# Altium schematic sheet MiniAB-Board.schdoc
size A4
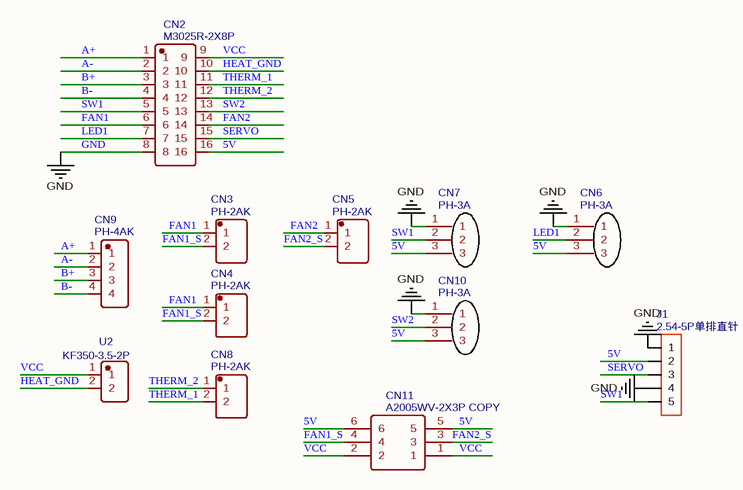
[diagram p0: MiniAB-Board.schdoc]

## Parts
CN2  M3025R-2X8P  [CONN-TH_M3025R-2X8P]
CN3  PH-2AK  [CONN-TH_PH-2A]
CN4  PH-2AK  [CONN-TH_PH-2A]
CN5  PH-2AK  [CONN-TH_PH-2A]
CN6  PH-3A  [CONN-TH_3P-P2.00_PH-3AK]
CN7  PH-3A  [CONN-TH_3P-P2.00_PH-3AK]
CN8  PH-2AK  [CONN-TH_PH-2A]
CN9  PH-4AK  [CONN-TH_PH-4AK]
CN10  PH-3A  [CONN-TH_3P-P2.00_PH-3AK]
CN11  A2005WV-2X3P COPY  [HDR-TH_6P-P2.00-V-M-R2-C3-S2.00]
J1  2.54-5P单排直针  [2.54-5P直针]
U2  KF350-3.5-2P  [CONN-TH_P3.50_KF350-3.5-2P]

## Nets
GND: CN2.8 CN6.1 CN7.1 CN10.1 J1.1 J1.4
5V: CN2.16 CN6.3 CN7.3 CN10.3 CN11.5 CN11.6 J1.2
A+: CN2.1 CN9.1
A-: CN2.2 CN9.2
B+: CN2.3 CN9.3
B-: CN2.4 CN9.4
FAN1: CN2.6 CN3.1 CN4.1
FAN1_S: CN3.2 CN4.2 CN11.4
FAN2: CN2.14 CN5.1
FAN2_S: CN5.2 CN11.3
HEAT_GND: CN2.10 U2.2
LED1: CN2.7 CN6.2
SERVO: CN2.15 J1.3
SW1: CN2.5 CN7.2 J1.5
SW2: CN2.13 CN10.2
THERM_1: CN2.11 CN8.2
THERM_2: CN2.12 CN8.1
VCC: CN2.9 CN11.1 CN11.2 U2.1

## Library data of the parts
CN2 = M3025R-2X8P: BOM_Manufacturer: XFCN(台湾兴飞); Contributor: LCSC; BOM_Supplier: LCSC; BOM_Supplier Part: C501326; BOM_Manufacturer Part: M3025R-2x8P; spicePre: C; spiceSymbolName: M3025R-2X8P
CN3-CN5 CN8 = PH-2AK: BOM_Manufacturer: BOOMELE; spicePre: X; BOM_Supplier: LCSC; BOM_Manufacturer Part: PH-2AK; BOM_Supplier Part: C8886; BOM_JLCPCB Part Class: Extended Part; spiceSymbolName: PH-2AK
CN6 CN7 CN10 = PH-3A: BOM_Manufacturer: Boom Precision Elec; Contributor: LCSC; BOM_Supplier: LCSC; BOM_Supplier Part: C146083; BOM_Manufacturer Part: PH-3A; BOM_JLCPCB Part Class: Extended Part; spicePre: C; spiceSymbolName: PH-3A
CN9 = PH-4AK: BOM_Manufacturer: CAX(创都); Contributor: LCSC; BOM_Supplier: LCSC; BOM_Supplier Part: C722776; BOM_Manufacturer Part: PH-4AK; BOM_JLCPCB Part Class: Extended Part; spicePre: C; spiceSymbolName: PH-4AK
CN11 = A2005WV-2X3P COPY: BOM_Manufacturer: Changjiang Connectors; Contributor: LCSC; BOM_Supplier: LCSC; BOM_Supplier Part: C225288; BOM_Manufacturer Part: A2005WV-2x3P; BOM_JLCPCB Part Class: Extended Part; spicePre: C; spiceSymbolName: A2005WV-2X3P COPY
J1 = 2.54-5P单排直针: Contributor: xf18898418890; spicePre: J; spiceSymbolName: 2.54-5P单排直针
U2 = KF350-3.5-2P: BOM_Manufacturer: Cixi Kefa Elec; Contributor: LCSC; BOM_Supplier: LCSC; BOM_Supplier Part: C474892; BOM_Manufacturer Part: KF350-3.5-2P; BOM_JLCPCB Part Class: Extended Part; spicePre: U; spiceSymbolName: KF350-3.5-2P